# Altium schematic sheet 4 Interfaces.SchDoc
size A3 portrait; Organization: Altium Limited; Address1: L3, 12a Rodborough Rd; Address2: Frenchs Forest; Address3: NSW; Address4: Australia 2086; DocumentNumber: 4; SheetNumber: 4; SheetTotal: 5; PageSetup: Record=PageOptions|CenterHorizontal=True|CenterVertical=True|PrintScale=1.00|XCorrection=1.00|YCorrection=1.00|PrintKind=1|BorderSize=5000000|LeftOffset=0|BottomOffset=0|Orientation=2|PaperLength=1000|PaperWidth=1000|Scale=100|PaperSource=15|PrintQuality=1200|MediaType=1|DitherType=10|PaperKind=A3|PrintScaleMode=1; Weight: -; ScaleFactor: -; NormInspection: Норм.Контр.
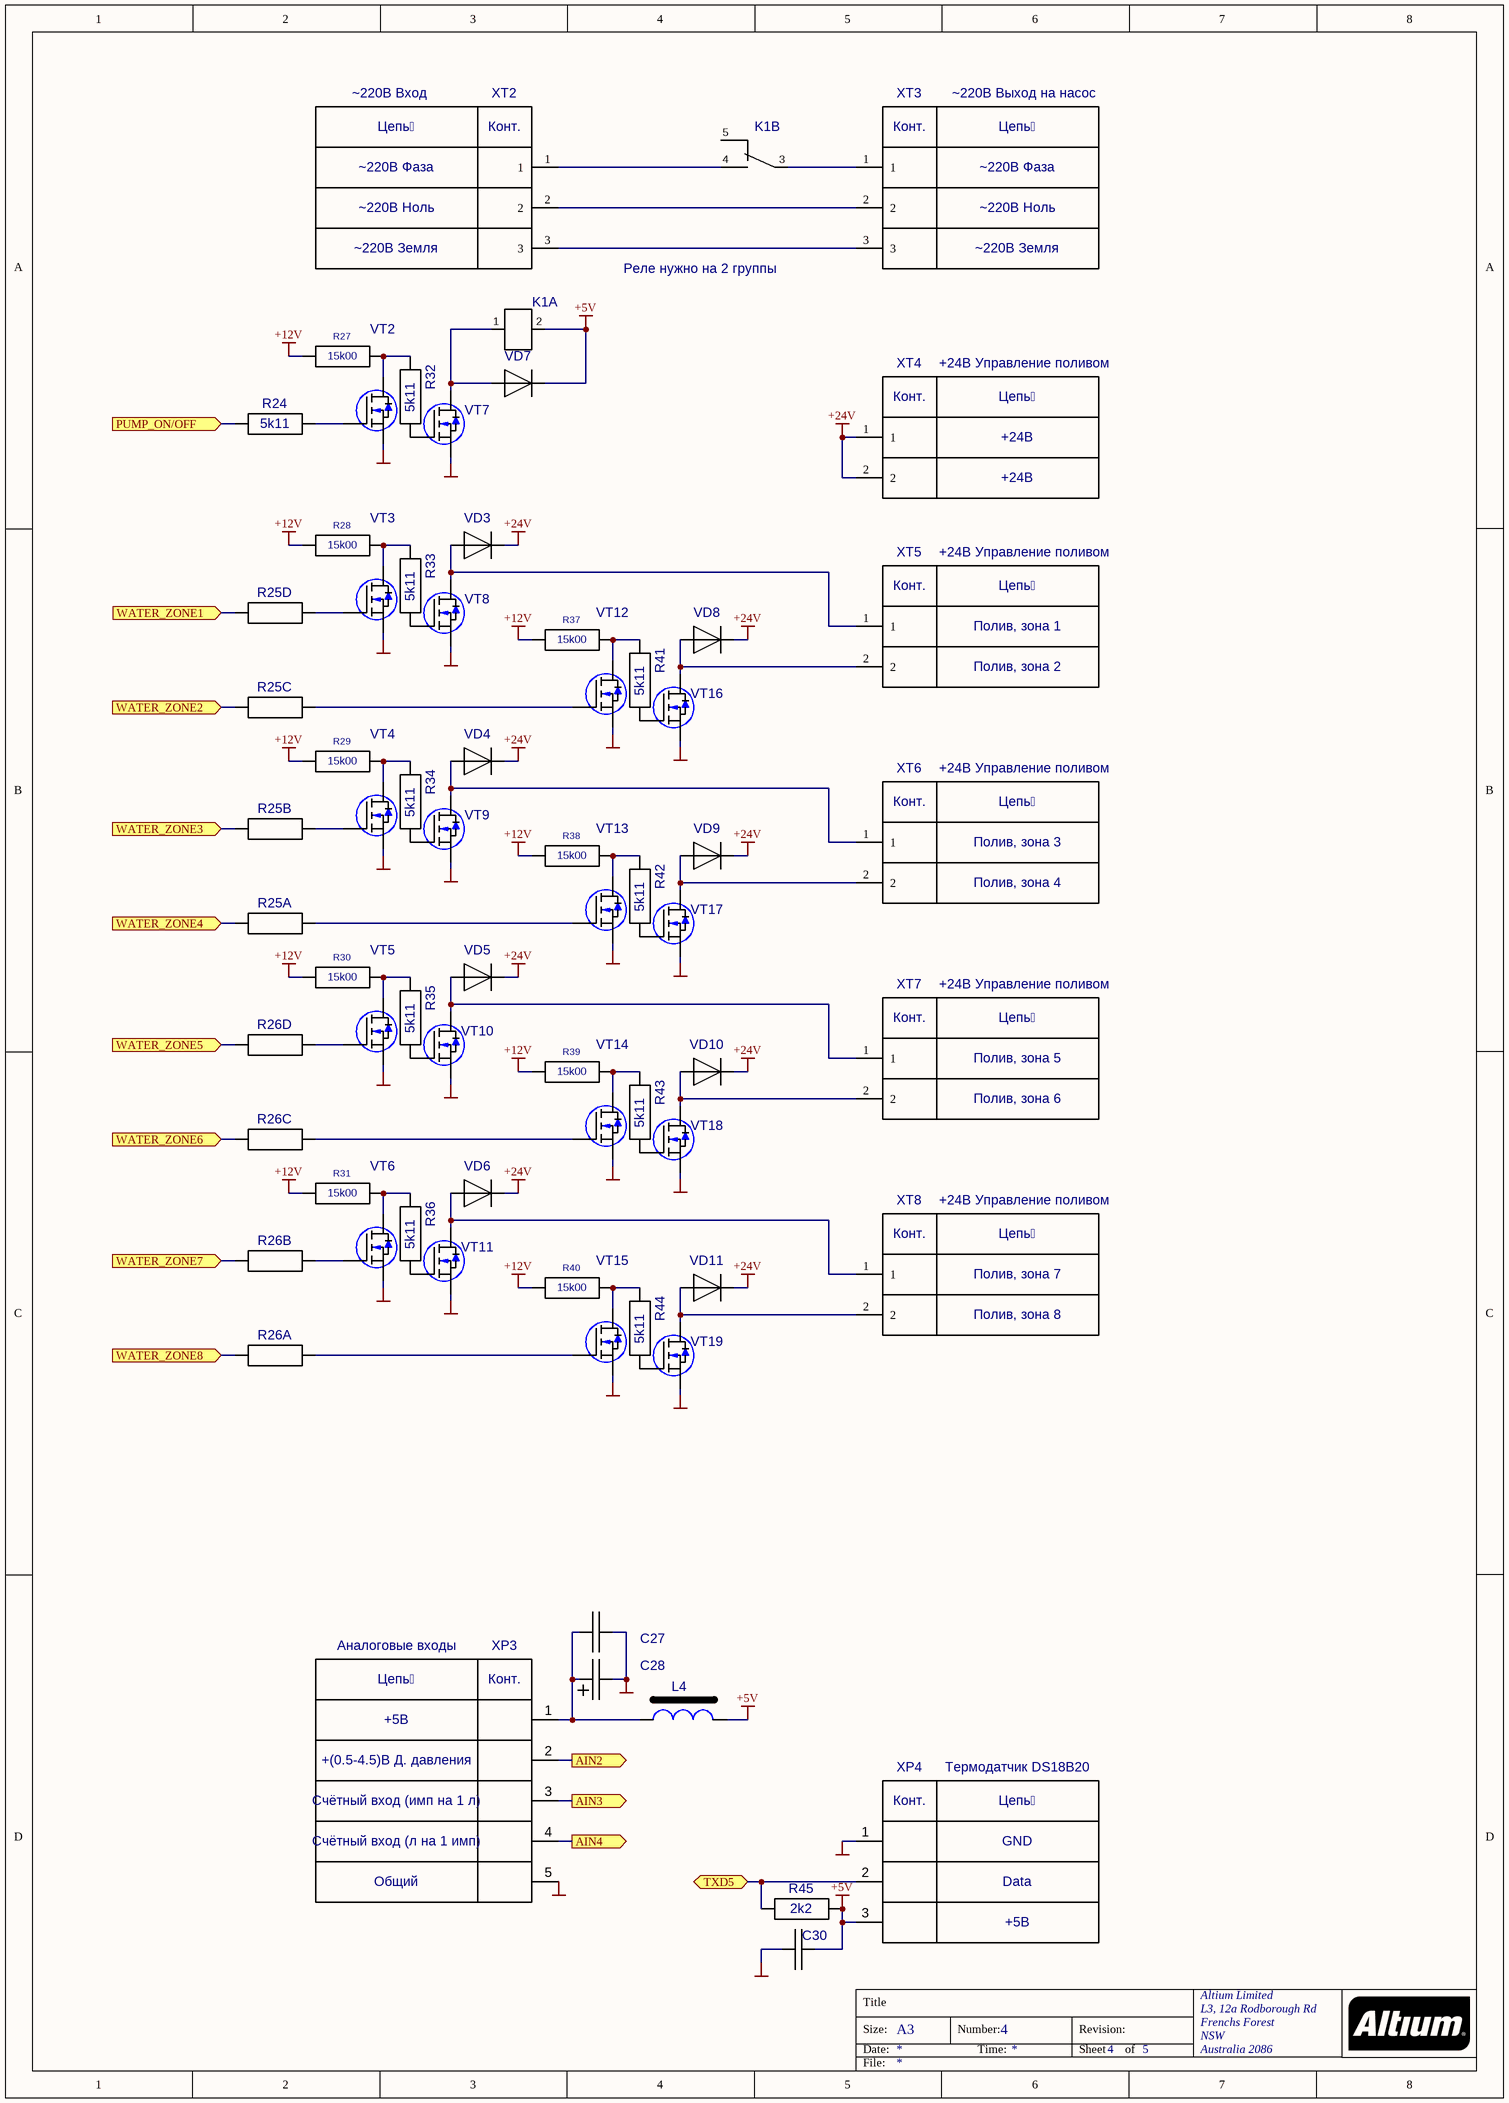
[diagram p0: 4 Interfaces.SchDoc]

## Parts
C27  C0402  [0402_CAP]  (value not drawn)
C28  10.0x16V  [TC3216-A]  (value not drawn)
C30  C0402  [0402_CAP]  (value not drawn)
K1  TRV-5VDC-SC-CD  [TRV-5VDC-SC-CD]  (value not drawn)  (parts A,B of 2)
L4  100µH LQH43CN101K  [LQH43]  (value not drawn)
R24  5k11  [0603_RES]
R25  4k7 CAT16-472J4  [CAT16]  (value not drawn)  (parts A,B,C,D of 4)
R26  4k7 CAT16-472J4  [CAT16]  (value not drawn)  (parts A,B,C,D of 4)
R27  15k00  [0603_RES]
R28  15k00  [0603_RES]
R29  15k00  [0603_RES]
R30  15k00  [0603_RES]
R31  15k00  [0603_RES]
R32  5k11  [0603_RES]
R33  5k11  [0603_RES]
R34  5k11  [0603_RES]
R35  5k11  [0603_RES]
R36  5k11  [0603_RES]
R37  15k00  [0603_RES]
R38  15k00  [0603_RES]
R39  15k00  [0603_RES]
R40  15k00  [0603_RES]
R41  5k11  [0603_RES]
R42  5k11  [0603_RES]
R43  5k11  [0603_RES]
R44  5k11  [0603_RES]
R45  2k2  [0603_RES]
VD3  ES1D  [SMA]  (value not drawn)
VD4  ES1D  [SMA]  (value not drawn)
VD5  ES1D  [SMA]  (value not drawn)
VD6  ES1D  [SMA]  (value not drawn)
VD7  ES1D  [SMA]  (value not drawn)
VD8  ES1D  [SMA]  (value not drawn)
VD9  ES1D  [SMA]  (value not drawn)
VD10  ES1D  [SMA]  (value not drawn)
VD11  ES1D  [SMA]  (value not drawn)
VT2  MMBF170Q-7-F  [SOT-23 MOSFET]  (value not drawn)
VT3  MMBF170Q-7-F  [SOT-23 MOSFET]  (value not drawn)
VT4  MMBF170Q-7-F  [SOT-23 MOSFET]  (value not drawn)
VT5  MMBF170Q-7-F  [SOT-23 MOSFET]  (value not drawn)
VT6  MMBF170Q-7-F  [SOT-23 MOSFET]  (value not drawn)
VT7  AO3400A  [SOT-23 MOSFET]  (value not drawn)
VT8  AO3400A  [SOT-23 MOSFET]  (value not drawn)
VT9  AO3400A  [SOT-23 MOSFET]  (value not drawn)
VT10  AO3400A  [SOT-23 MOSFET]  (value not drawn)
VT11  AO3400A  [SOT-23 MOSFET]  (value not drawn)
VT12  MMBF170Q-7-F  [SOT-23 MOSFET]  (value not drawn)
VT13  MMBF170Q-7-F  [SOT-23 MOSFET]  (value not drawn)
VT14  MMBF170Q-7-F  [SOT-23 MOSFET]  (value not drawn)
VT15  MMBF170Q-7-F  [SOT-23 MOSFET]  (value not drawn)
VT16  AO3400A  [SOT-23 MOSFET]  (value not drawn)
VT17  AO3400A  [SOT-23 MOSFET]  (value not drawn)
VT18  AO3400A  [SOT-23 MOSFET]  (value not drawn)
VT19  AO3400A  [SOT-23 MOSFET]  (value not drawn)
XP3  PH-5  [PH-5]  (value not drawn)  (parts A,B,C,D,E of 5)
XP4  PH-3  [PH-3]  (value not drawn)  (parts A,B,C of 3)
XT2  XY301VA-5.0-3P-12  [301-031-12]  (value not drawn)  (parts A,B,C of 3)
XT3  XY301VA-5.0-3P-12  [301-031-12]  (value not drawn)  (parts A,B,C of 3)
XT4  XY301VA-5.0-2P-12  [301-021-12]  (value not drawn)  (parts A,B of 2)
XT5  XY301VA-5.0-2P-12  [301-021-12]  (value not drawn)  (parts A,B of 2)
XT6  XY301VA-5.0-2P-12  [301-021-12]  (value not drawn)  (parts A,B of 2)
XT7  XY301VA-5.0-2P-12  [301-021-12]  (value not drawn)  (parts A,B of 2)
XT8  XY301VA-5.0-2P-12  [301-021-12]  (value not drawn)  (parts A,B of 2)

## Ports
AIN2 (out), AIN3 (out), AIN4 (out), PUMP_ON/OFF (in), TXD5 (bidir), WATER_ZONE1 (in), WATER_ZONE2 (in), WATER_ZONE3 (in), WATER_ZONE4 (in), WATER_ZONE5 (in), WATER_ZONE6 (in), WATER_ZONE7 (in), WATER_ZONE8 (in)

## Nets
+5V: C30.1 K1.2 L4.2 R45.2 VD7.2(K) XP4.3
+12V: R27.1 R28.1 R29.1 R30.1 R31.1 R37.1 R38.1 R39.1 R40.1
+24V: VD3.2(K) VD4.2(K) VD5.2(K) VD6.2(K) VD8.2(K) VD9.2(K) VD10.2(K) VD11.2(K) XT4.1 XT4.2
GND: C27.2 C28.2 C30.2 VT2.2(S) VT3.2(S) VT4.2(S) VT5.2(S) VT6.2(S) VT7.2(S) VT8.2(S) VT9.2(S) VT10.2(S) VT11.2(S) VT12.2(S) VT13.2(S) VT14.2(S) VT15.2(S) VT16.2(S) VT17.2(S) VT18.2(S) VT19.2(S) XP3.5 XP4.1
AIN2: XP3.2 ; port AIN2
AIN3: XP3.3 ; port AIN3
AIN4: XP3.4 ; port AIN4
PUMP_ON/OFF: R24.1 ; port PUMP_ON/OFF
TXD5: R45.1 XP4.2 ; port TXD5
WATER_ZONE1: R25.7 ; port WATER_ZONE1
WATER_ZONE2: R25.5 ; port WATER_ZONE2
WATER_ZONE3: R25.3 ; port WATER_ZONE3
WATER_ZONE4: R25.1 ; port WATER_ZONE4
WATER_ZONE5: R26.7 ; port WATER_ZONE5
WATER_ZONE6: R26.5 ; port WATER_ZONE6
WATER_ZONE7: R26.3 ; port WATER_ZONE7
WATER_ZONE8: R26.1 ; port WATER_ZONE8
NetC27_1: C27.1 C28.1 L4.1 XP3.1
NetK1_1: K1.1 VD7.1(A) VT7.3(D)
NetK1_3: K1.3 XT3.1
NetK1_4: K1.4 XT2.1
NetR24_2: R24.2 VT2.1(G)
NetR25_2: R25.2 VT13.1(G)
NetR25_4: R25.4 VT4.1(G)
NetR25_6: R25.6 VT12.1(G)
NetR25_8: R25.8 VT3.1(G)
NetR26_2: R26.2 VT15.1(G)
NetR26_4: R26.4 VT6.1(G)
NetR26_6: R26.6 VT14.1(G)
NetR26_8: R26.8 VT5.1(G)
NetR27_2: R27.2 R32.2 VT2.3(D)
NetR28_2: R28.2 R33.2 VT3.3(D)
NetR29_2: R29.2 R34.2 VT4.3(D)
NetR30_2: R30.2 R35.2 VT5.3(D)
NetR31_2: R31.2 R36.2 VT6.3(D)
NetR32_1: R32.1 VT7.1(G)
NetR33_1: R33.1 VT8.1(G)
NetR34_1: R34.1 VT9.1(G)
NetR35_1: R35.1 VT10.1(G)
NetR36_1: R36.1 VT11.1(G)
NetR37_2: R37.2 R41.2 VT12.3(D)
NetR38_2: R38.2 R42.2 VT13.3(D)
NetR39_2: R39.2 R43.2 VT14.3(D)
NetR40_2: R40.2 R44.2 VT15.3(D)
NetR41_1: R41.1 VT16.1(G)
NetR42_1: R42.1 VT17.1(G)
NetR43_1: R43.1 VT18.1(G)
NetR44_1: R44.1 VT19.1(G)
NetVD3_1: VD3.1(A) VT8.3(D) XT5.1
NetVD4_1: VD4.1(A) VT9.3(D) XT6.1
NetVD5_1: VD5.1(A) VT10.3(D) XT7.1
NetVD6_1: VD6.1(A) VT11.3(D) XT8.1
NetVD8_1: VD8.1(A) VT16.3(D) XT5.2
NetVD9_1: VD9.1(A) VT17.3(D) XT6.2
NetVD10_1: VD10.1(A) VT18.3(D) XT7.2
NetVD11_1: VD11.1(A) VT19.3(D) XT8.2
NetXT2_2: XT2.2 XT3.2
NetXT2_3: XT2.3 XT3.3

Not connected (* = marked no-connect by the designer): K1 5

## Notes on the sheet
- ~220В Вход
- XT2
- XT3
- ~220В Выход на насос
- ~220В Фаза
- Цепь
- (near XT2) Конт.
- (near XT3) Конт.
- ~220В Ноль
- ~220В Земля
- Реле нужно на 2 группы
- XT4
- +24В Управление поливом
- (near XT4) Конт.
- +24В
- XT5
- (near XT5) Конт.
- Полив, зона 1
- Полив, зона 2
- XT6
- (near XT6) Конт.
- Полив, зона 3
- Полив, зона 4
- (near XT7) Конт.
- XT7
- Полив, зона 5
- Полив, зона 6
- (near XT8) Конт.
- XT8
- Полив, зона 7
- Полив, зона 8
- Аналоговые входы
- XP3
- +5В
- (near XP3) Конт.
- +(0.5-4.5)В Д. давления
- XP4
- Термодатчик DS18B20
- (near XP3) Счётный вход (л на 1 имп)
- (near XP3) Счётный вход (имп на 1 л)
- (near XP4) Конт.
- GND
- Общий
- Data
- +5B
- Title
- Size:
- Date:
- A3
- Number:
- Time:
- Revision:
- Sheet
- of
- File:

## Library data of the parts
C27 C30 = C0402: Value: µ10x10V X7R
C28 = TC3216-A: Value: 10.0x16V
L4 = LQH43: LQH43, 1812; Value: 100µH LQH43CN101K
R24 R27-R45 = R0603
  R24 R32-R36 R41-R44: Value: 5k11
  R27-R31 R37-R40: Value: 15k00
  R45: Value: 2k2
R25 R26 = CAT16: CAT16-472J4; Value: 4k7 CAT16-472J4
VT2-VT6 VT12-VT15 = MMBF170: Value: MMBF170Q-7-F
VT7-VT11 VT16-VT19 = IRLML2060TRPBF: Value: AO3400A
XP3 = PH-5: Value: B5B-PH-K-S(LF)(SN)
XP4 = PH-3: Value: B3B-PH-K-S(LF)(SN)
XT2 XT3 = 301-031-12: Клеммник винтовой, 3-контактный, 5мм, прямой; Value: XY301VA-5.0-3P-12
XT4-XT8 = 301-021-12: Клеммник винтовой, 2-контактный, 5мм, прямой; Value: XY301VA-5.0-2P-12
K1 = TRV-5VDC-SC-CD: Value: TRV-5VDC-SC-CD
VD3-VD11 = ES1D: Value: ES1D